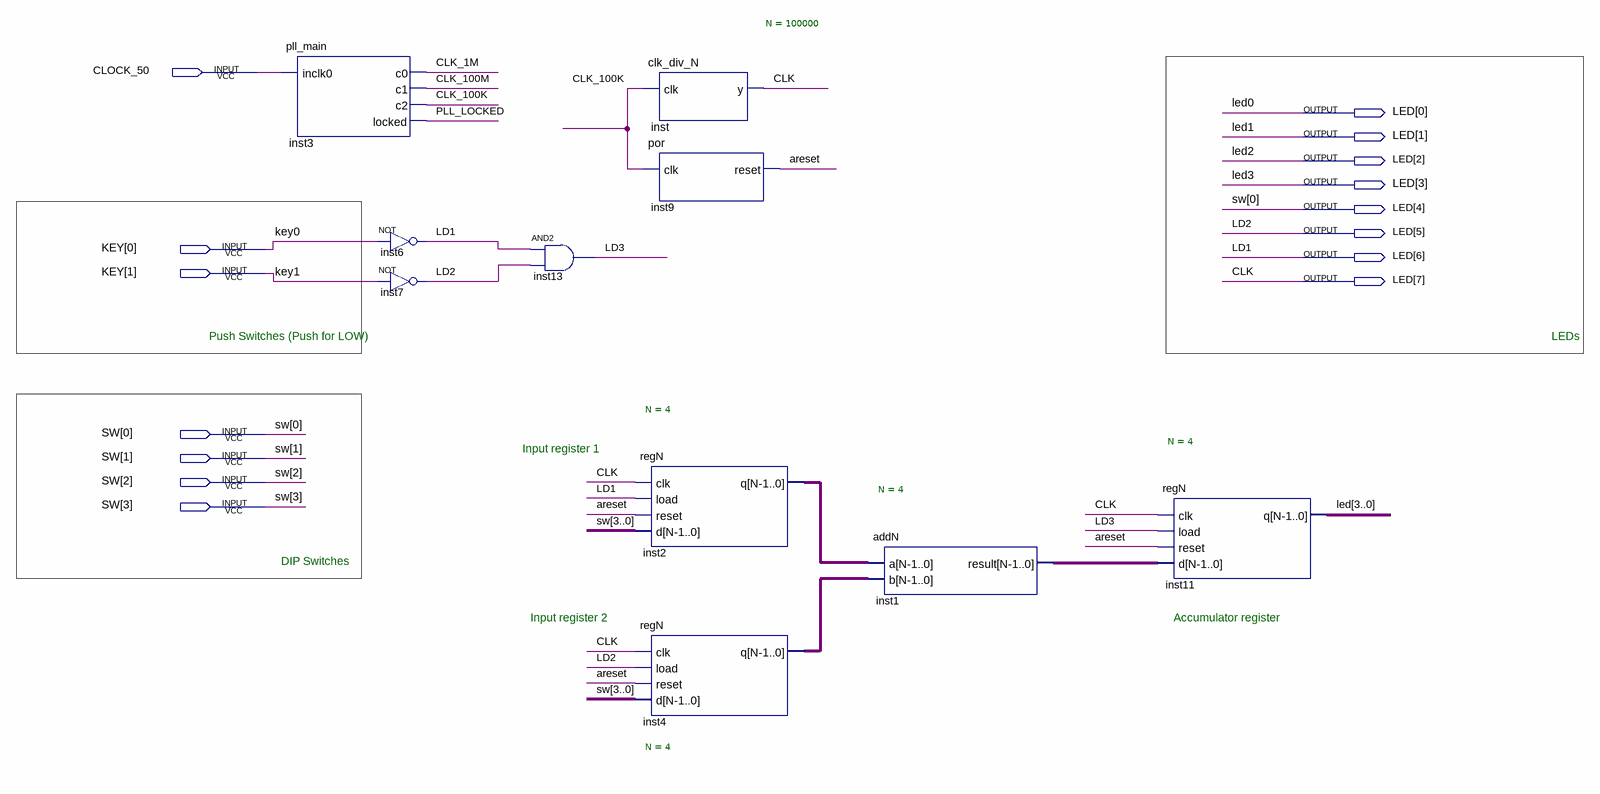
[diagram p0: schematic sheet]
// Quartus schematic TopLevelSchematic.bdf as structural Verilog: 10 symbols, 15 pins
module TopLevelSchematic (
  input  CLOCK_50,
  input  [1:0] KEY,
  input  [3:0] SW,
  output [7:0] LED
);

  wire areset, CLK_1M, CLK_100K, CLK_100M, LD3, PLL_LOCKED;
  wire [3:0] inst1_result, inst2_q, inst4_q;

  pll_main inst3 (.inclk0(CLOCK_50), .c0(CLK_1M), .c1(CLK_100M), .c2(CLK_100K), .locked(PLL_LOCKED));
  not inst6 (LED[6], KEY[0]);
  not inst7 (LED[5], KEY[1]);
  and inst13 (LD3, LED[6], LED[5]);
  clk_div_N #(.N(100000)) inst (.clk(CLK_100K), .y(LED[7]));
  por inst9 (.clk(CLK_100K), .reset(areset));
  regN #(.N(4)) inst2 (.clk(LED[7]), .load(LED[6]), .reset(areset), .d(SW), .q(inst2_q));
  regN #(.N(4)) inst4 (.clk(LED[7]), .load(LED[5]), .reset(areset), .d(SW), .q(inst4_q));
  addN #(.N(4)) inst1 (.a(inst2_q), .b(inst4_q), .result(inst1_result));
  regN #(.N(4)) inst11 (.clk(LED[7]), .load(LD3), .reset(areset), .d(inst1_result), .q(LED[3:0]));

  assign LED[4] = SW[0];

  // Other names for the same wires on the sheet: CLK = LED[7]; LD1 = LED[6]; LD2 = LED[5]

  // Notes on the sheet:
  //   Push Switches (Push for LOW)
  //   LEDs
  //   Input register 1
  //   DIP Switches
  //   Input register 2
  //   Accumulator register
endmodule
